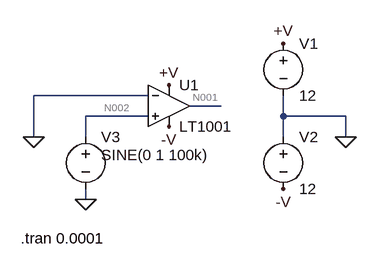
[diagram p0: schematic opamp non inverting.asc]
opamp non inverting.asc, the LTspice schematic file:
Version 4
SHEET 1 880 680
WIRE 144 160 -32 160
WIRE 256 176 208 176
WIRE 144 192 48 192
WIRE 352 192 352 160
WIRE 448 192 352 192
WIRE -32 224 -32 160
WIRE 48 224 48 192
WIRE 352 224 352 192
WIRE 448 224 448 192
WIRE 48 320 48 304
FLAG 352 80 +V
FLAG 176 144 +V
FLAG 176 208 -V
FLAG 352 304 -V
FLAG -32 224 0
FLAG 48 320 0
FLAG 448 224 0
SYMBOL Opamps\\LT1001 176 112 R0
SYMATTR InstName U1
SYMBOL voltage 352 64 R0
SYMATTR InstName V1
SYMATTR Value 12
SYMBOL voltage 352 208 R0
SYMATTR InstName V2
SYMATTR Value 12
SYMBOL voltage 48 208 R0
WINDOW 3 24 44 Left 2
WINDOW 123 24 124 Left 2
WINDOW 39 0 0 Left 2
SYMATTR InstName V3
SYMATTR Value SINE(0 1 100k)
TEXT -52 380 Left 2 !.tran 0.0001

The netlist it stands for:
* opamp non inverting.asc
XU1 N002 0 +V -V N001 LT1001  ; pins In+ In- V+ V- OUT
V1 +V 0 12
V2 0 -V 12
V3 N002 0 SINE(0 1 100k)
.tran 0.0001
.lib LTC.lib
.backanno
.end

* Results of the author's LTspice run, read from the files saved beside the schematic
* Operating Point, zero values left out:
*   V(+v) = 12 V
*   V(-v) = -12 V
*   I(V2) = -2.25 mA
*   I(V1) = -2.25 mA
*   Ix(u1:3) = 2.25 mA
*   Ix(u1:4) = -2.25 mA
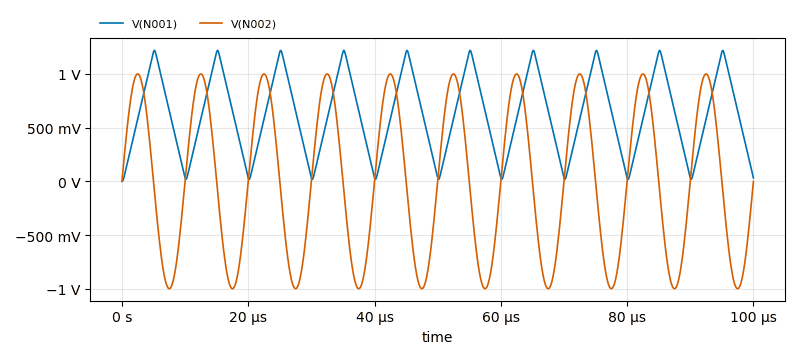
[diagram p1: Transient Analysis of opamp non inverting.asc, plotted from the saved traces]
* Transient Analysis, 1 run:
*   V(N001): min 0 V, max 1.217 V, average 617.5 mV, rms 714.7 mV, last 31.06 mV
*   V(N002): min -998.9 mV, max 998.9 mV, average 3.023 µV, rms 706.3 mV, last 0 V